# EAGLE design seadoo_zs01_pcb (EAGLE 9.6.2)
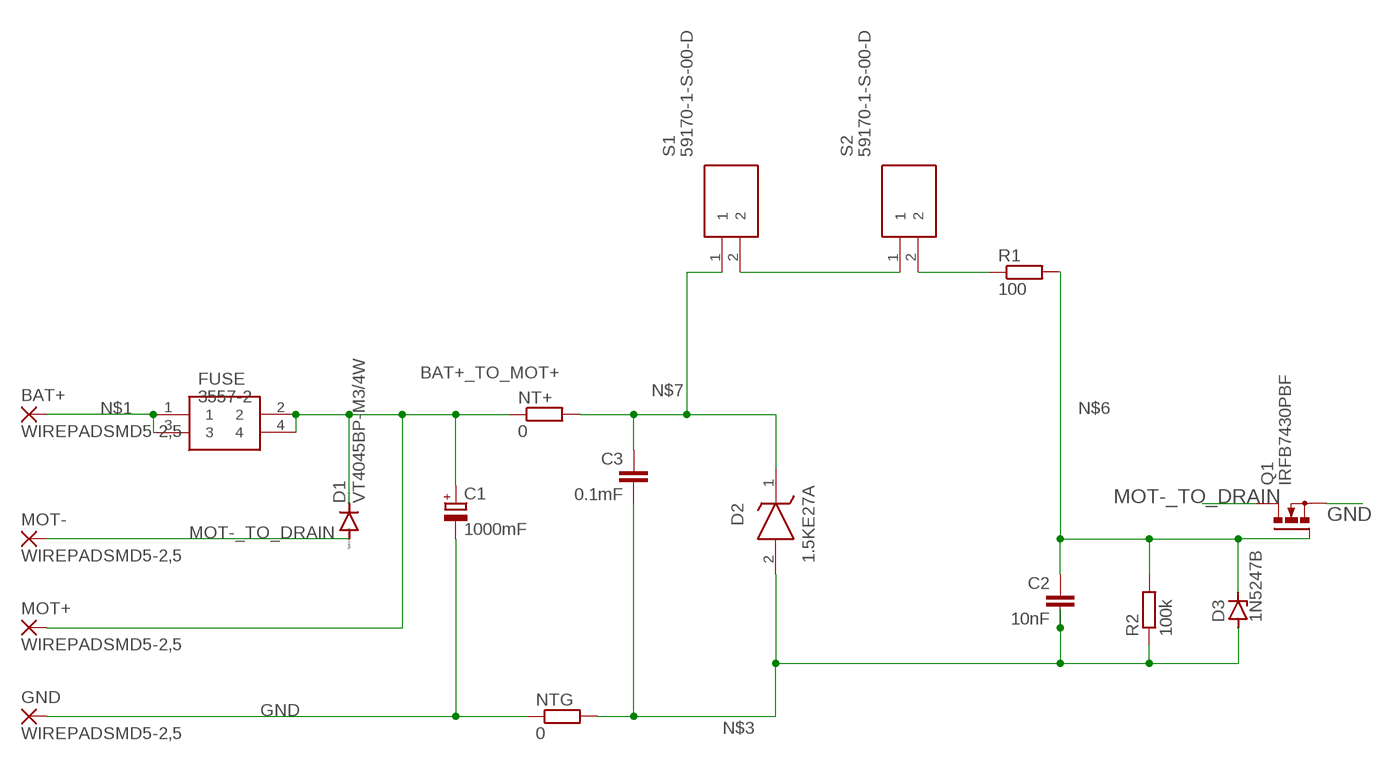
[diagram p0: schematic, sheet 1]

## Parts
BAT+  WIREPADSMD5-2,5  [5-2,5]
C1  1000mF  CPOL-EUTT5D11  [TT5D11]
C2  10nF  C5/3  [C5B3]
C3  0.1mF  C5/3  [C5B3]
D1  VT4045BP-M3/4W  DIODE-TO220H  [TO220AC]
D2  1.5KE27A  [DIOAD2920W106L900D505]
D3  1N5247B  ZENER-DIODEP1-12  [P1Z12]
FUSE  3557-2  [3557-2]
GND  WIREPADSMD5-2,5  [5-2,5]
MOT+  WIREPADSMD5-2,5  [5-2,5]
MOT-  WIREPADSMD5-2,5  [5-2,5]
NT+  0  R-EU_R1218  [R1218]
NTG  0  R-EU_R1218  [R1218]
Q1  IRFB7430PBF  PMOSFET_NTO220BH  [TO220BH]
R1  100  R-EU_0204/7  [0204/7]
R2  100k  R-EU_0204/7  [0204/7]
S1  59170-1-S-00-D  [591701S00D]
S2  59170-1-S-00-D  [591701S00D]

## Nets
BAT+_TO_MOT+ [POWER]: C1.+ D1.C FUSE.2 FUSE.4 MOT+.1(P) NT+.1
GND [POWER]: C1.- GND.1(P) NTG.1 Q1.S
MOT-_TO_DRAIN [POWER]: D1.A MOT-.1(P) Q1.D
N$1 [POWER]: BAT+.1(P) FUSE.1 FUSE.3
N$3 [SIGNAL]: C2.2 C3.2 D2.2(A) D3.A NTG.2 R2.1
N$4 [SIGNAL]: S1.2 S2.1
N$5 [SIGNAL]: R1.1 S2.2
N$6 [SIGNAL]: C2.1 D3.C Q1.G R1.2 R2.2
N$7 [SIGNAL]: C3.1 D2.1(K) NT+.2 S1.1

## Library data of the parts
BAT+ GND MOT+ MOT- = wirepad:WIREPAD: Wire PAD connect wire on PCB
C1 = rcl:CPOL-EU: POLARIZED CAPACITOR, European symbol; SPICEPREFIX: C
C2 C3 = capacitor-wima:C: CAPACITOR naming: grid - package width
D1 = diode:DIODE-: DIODE
D2 = 1.5KE27A:1.5KE27A: 1500 W, 23.1 V TVS in DO-201 Source: Datasheet <https://www.st.com/resource/en/datasheet/1-5ke100ca.pdf>; DESCRIPTION: 1500 W, 23.1 V TVS in DO-201; HEIGHT: mm; MANUFACTURER_NAME: STMicroelectronics; MANUFACTURER_PART_NUMBER: 1.5KE27A; MOUSER_PART_NUMBER: 511-1.5KE27A; MOUSER_PRICE-STOCK: https://www.mouser.co.uk/ProductDetail/STMicroelectronics/1.5KE27A?qs=m4gxtLzGBzrDoABe76ebWA%3D%3D
D3 = diode:ZENER-DIODE: Z-Diode
FUSE = 3557-2:3557-2: THM 2 in 1 Auto Blade Holder P/N 3557-2 Source: Datasheet <http://www.keyelco.com/product-pdf.cfm?p=296>; DESCRIPTION: THM 2 in 1 Auto Blade Holder P/N 3557-2; HEIGHT: mm; MANUFACTURER_NAME: Keystone Electronics; MANUFACTURER_PART_NUMBER: 3557-2
NT+ NTG R1 R2 = rcl:R-EU_: RESISTOR, European symbol; SPICEPREFIX: R
Q1 = transistor-power:PMOSFET_N: Power MOSFET N-Channel
S1 S2 = 59170-1-S-00-D:59170-1-S-00-D: Magnetic / Reed Switches 59170-1-S-00-D SENSOR Source: Datasheet; DESCRIPTION: Magnetic / Reed Switches 59170-1-S-00-D SENSOR; HEIGHT: 2.417mm; MANUFACTURER_NAME: LITTELFUSE; MANUFACTURER_PART_NUMBER: 59170-1-S-00-D

## Net classes
1 POWER: width 2.032 mm, drill 0.508 mm, clearance 0.508 mm
2 SIGNAL: width 0.152 mm, drill 0.152 mm, clearance 0.152 mm

## Board
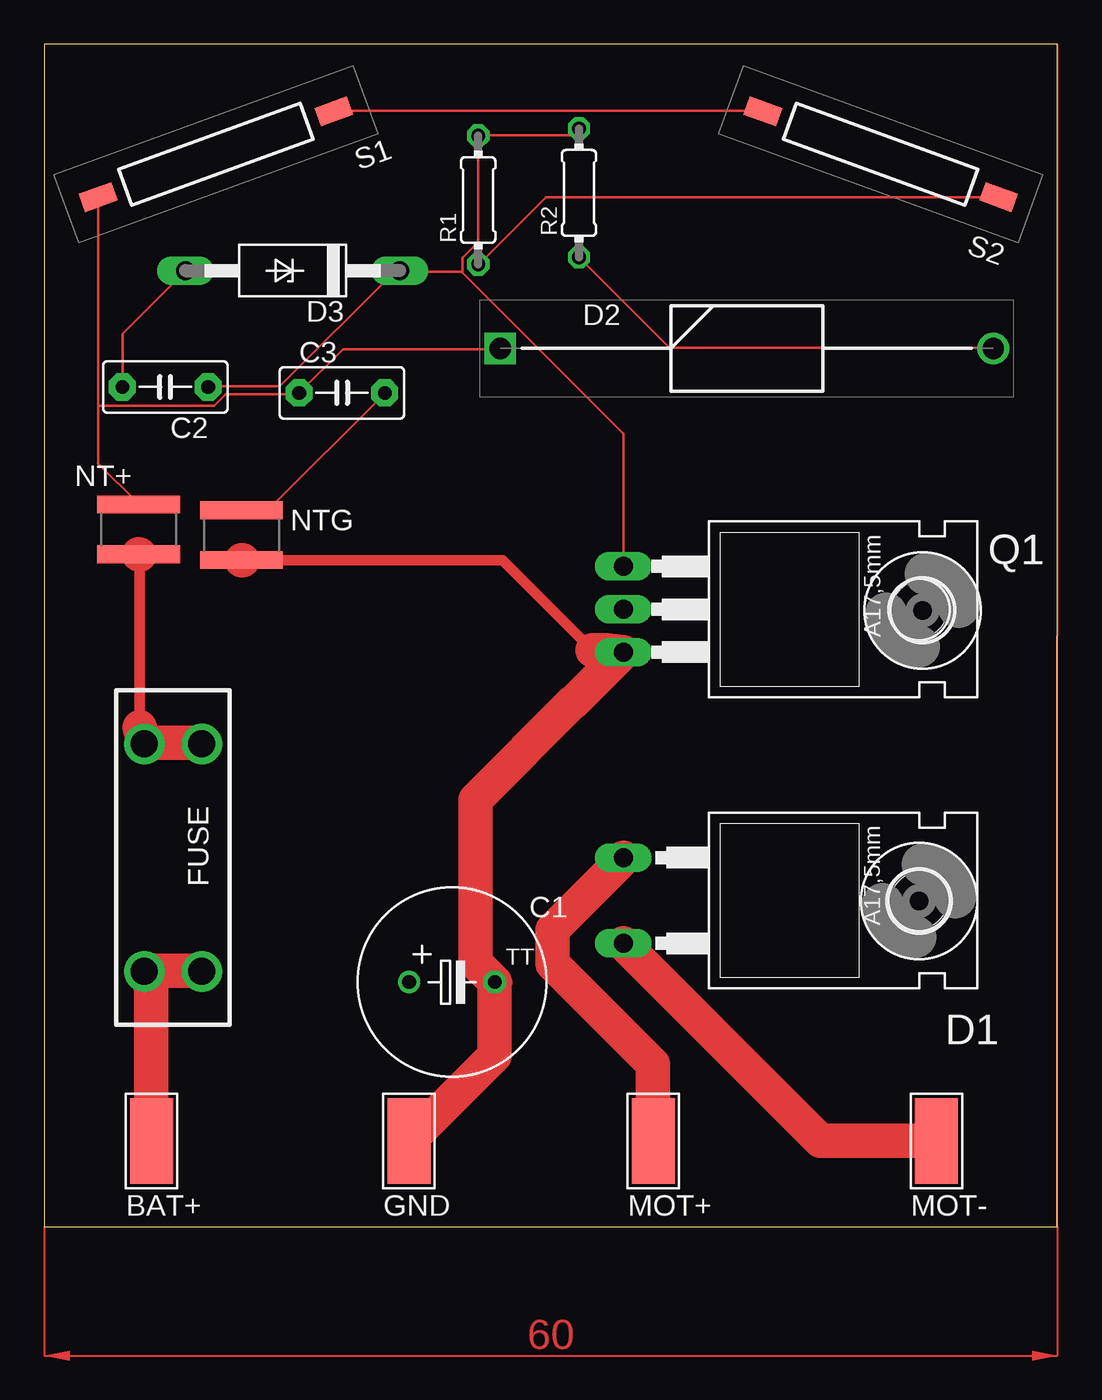
[diagram p1: board, top side]
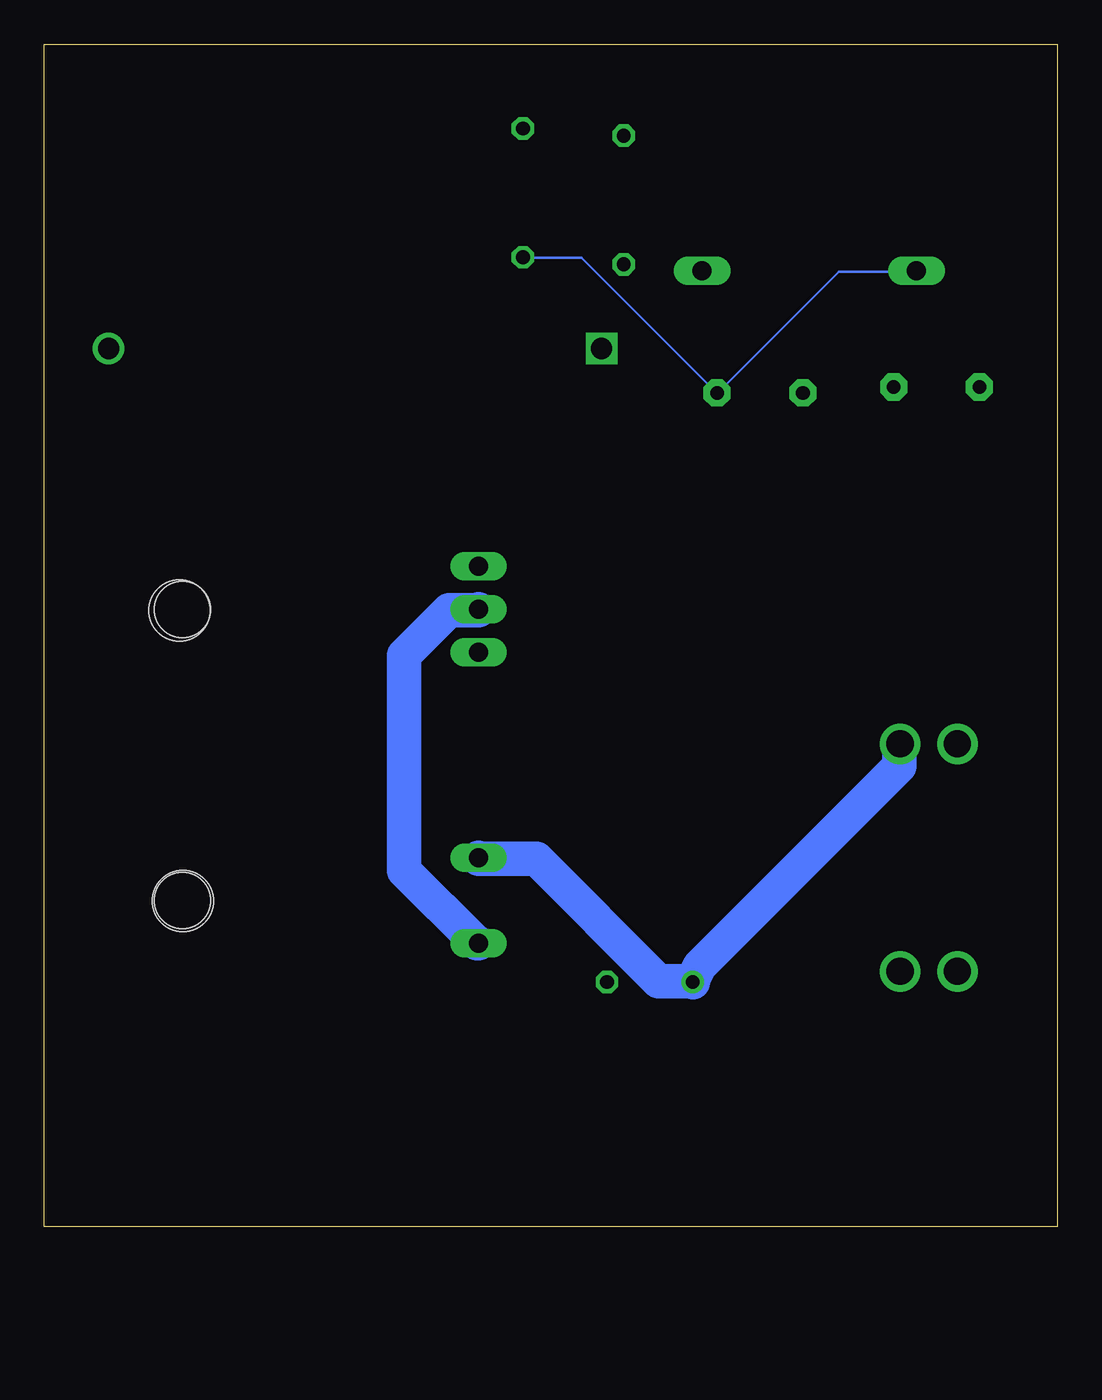
[diagram p2: board, bottom side, seen from below]

Size 60 x 70 mm. Coordinates in mm from the lower left corner, seen from the top.
Outline: 0,0 60,0 60,70 0,70 0,0
Copper layers (1*16): Top 0.035mm / dielectric 1.5mm / Bottom 0.035mm
Design rules "default": minimum track width 6mil, minimum drill 0.35mm, track to track 6mil, track to pad 6mil, pad to pad 6mil, via to via 6mil, smd to smd 6mil, copper to edge 40mil, drill to drill 6mil, minimum pad ring 10mil, minimum via ring 8mil, stop-mask expansion 4mil, vias tented up to drill 0mil, thermal gap 10mil

### Footprints (pad centres in the part's own frame; a part is rotated, then mirrored left to right if it is on the bottom)
5-2,5 = smd 2.54 x 5.08: 1 0,0
TT5D11 = drill 0.813: + -2.54,0 | drill 0.813 octagon: - 2.54,0
C5B3 = drill 0.813 pad 1.6 octagon: 1 -2.54,0; 2 2.54,0
TO220AC = drill 1.118 long: A 2.54,-6.35; C -2.54,-6.35 | hole 3.302: 0,11.176
DIOAD2920W106L900D505 = drill 1.25 pad 1.875 square: 1 0,0 | drill 1.25 pad 1.875: 2 29.2,0
P1Z12 = drill 1.118 long: A 6.35,0; C -6.35,0
3557-2 = drill 1.6 pad 2.4: 1 -6.735,1.7; 2 6.735,1.7; 3 -6.735,-1.7; 4 6.735,-1.7
R1218 = smd 1.05 x 4.9: 1 -1.475,0; 2 1.475,0
TO220BH = drill 1.118 long: D 0,-6.35; G -2.54,-6.35; S 2.54,-6.35 | hole 3.302: 0,11.176
0204/7 = drill 0.813 octagon: 1 -3.81,0; 2 3.81,0
591701S00D = smd 2.03 x 1.14: 1 -7.425,0; 2 7.425,0
3,6 = hole 3.6: 0,0

### Placement (x,y rotation side)
BAT+  6.35,5.08 0 top
C1  24.14,14.49 0 top
C2  7.16,49.72 180 top
C3  17.62,49.37 0 top
D1  40.64,19.32 270 top
D2  27,52 0 top
D3  14.7,56.61 180 top
FUSE  7.62,21.86 90 top
GND  21.59,5.08 0 top
MOT+  36.07,5.08 0 top
MOT-  52.83,5.08 0 top
NT+  5.59,41.29 90 top
NTG  11.67,40.95 90 top
Q1  40.64,36.56 270 top
R1  25.69,60.79 90 top
R2  31.66,61.21 90 top
S1  10.16,63.5 20 top
S2  49.53,63.5 340 top
U$1  [3,6]  52,36.5 0 top
U$2  [3,6]  51.8,19.3 0 top

### Tracks (layer width: path | path; a pad name or v marks a point on that pad's centre or on a via)
BAT+_TO_MOT+
  Top 0.61: 5.64,29.57 5.64,39.78
  Top 2.032: FUSE.4 9.3,28.65 5.94,28.65 FUSE.2 5.64,29.57 | 5.64,39.78 NT+.1 | MOT+.1 36.04,5.11 36.04,9.62 30.09,15.57 30.09,17.59 34.29,21.79 D1.C
  Bottom 2.032: 21.64,14.55 23.62,14.55 30.86,21.79 34.29,21.79 D1.C | 21.64,14.55 C1.+ | FUSE.4 9.37,28.57 9.37,27.28 21.18,15.47 21.64,14.55
GND
  Top 0.61: 11.73,39.47 27.13,39.47 32.46,34.14
  Top 2.032: GND.1 21.64,5.11 26.67,10.13 26.67,14.48 C1.- 25.53,15.64 25.53,25.3 31.29,31.06 31.33,31.06 Q1.S 33.3,34.14 32.46,34.14 | 11.73,39.47 NTG.1
MOT-_TO_DRAIN
  Top 2.032: MOT-.1 52.81,5.11 45.95,5.11 34.29,16.76 D1.A
  Bottom 2.032: D1.A 34.39,16.78 38.69,21.08 38.69,33.85 36.04,36.5 34.29,36.5 Q1.D
N$1
  Top 2.032: FUSE.3 9.3,15.16 5.94,15.16 FUSE.1 6.33,14.17 6.33,5.11 BAT+.1
N$3
  Top 0.152: C2.2 4.65,49.76 4.65,52.88 8.31,56.54 D3.A | D2.2 56.16,52.05 37.03,52.05 31.7,57.38 R2.1 | NTG.2 11.73,42.44 13.26,42.44 20.12,49.3 C3.2
  Bottom 0.152: R2.1 31.62,57.38 28.19,57.38 20.19,49.38 C3.2 20.12,49.38 12.95,56.54 8.38,56.54 D3.A
N$4
  Top 0.152: S1.2 17.14,66.06 42.52,66.06 S2.1
N$5
  Top 0.152: S2.2 56.46,60.96 29.72,60.96 25.76,57 R1.1
N$6
  Top 0.152: R2.2 31.62,65 31.24,64.62 25.76,64.62 R1.2 25.68,64.54 25.68,58.29 24.77,57.38 24.77,56.54 24.73,56.5 | C2.1 9.75,49.76 13.95,49.76 20.73,56.54 21.03,56.54 D3.C 21.11,56.54 24.69,56.54 24.73,56.5 | Q1.G 34.29,46.94 24.73,56.5
N$7
  Top 0.152: 3.2,48.62 3.2,45.19 5.56,42.82 NT+.2 | 3.2,48.62 3.2,60.96 S1.1 | 3.2,48.62 10.06,48.62 10.74,49.3 15.01,49.3 C3.1 17.68,51.97 26.98,51.97 D2.1
(copper drawn outside any net)
  shapes: Top area x2